# EasyEDA schematic pump system.json
TITLE: Sheet_1; REV: 1.0; Date: 2019-04-05; Sheet: 1/1; Drawn By: UserSupport; Company: Your Company
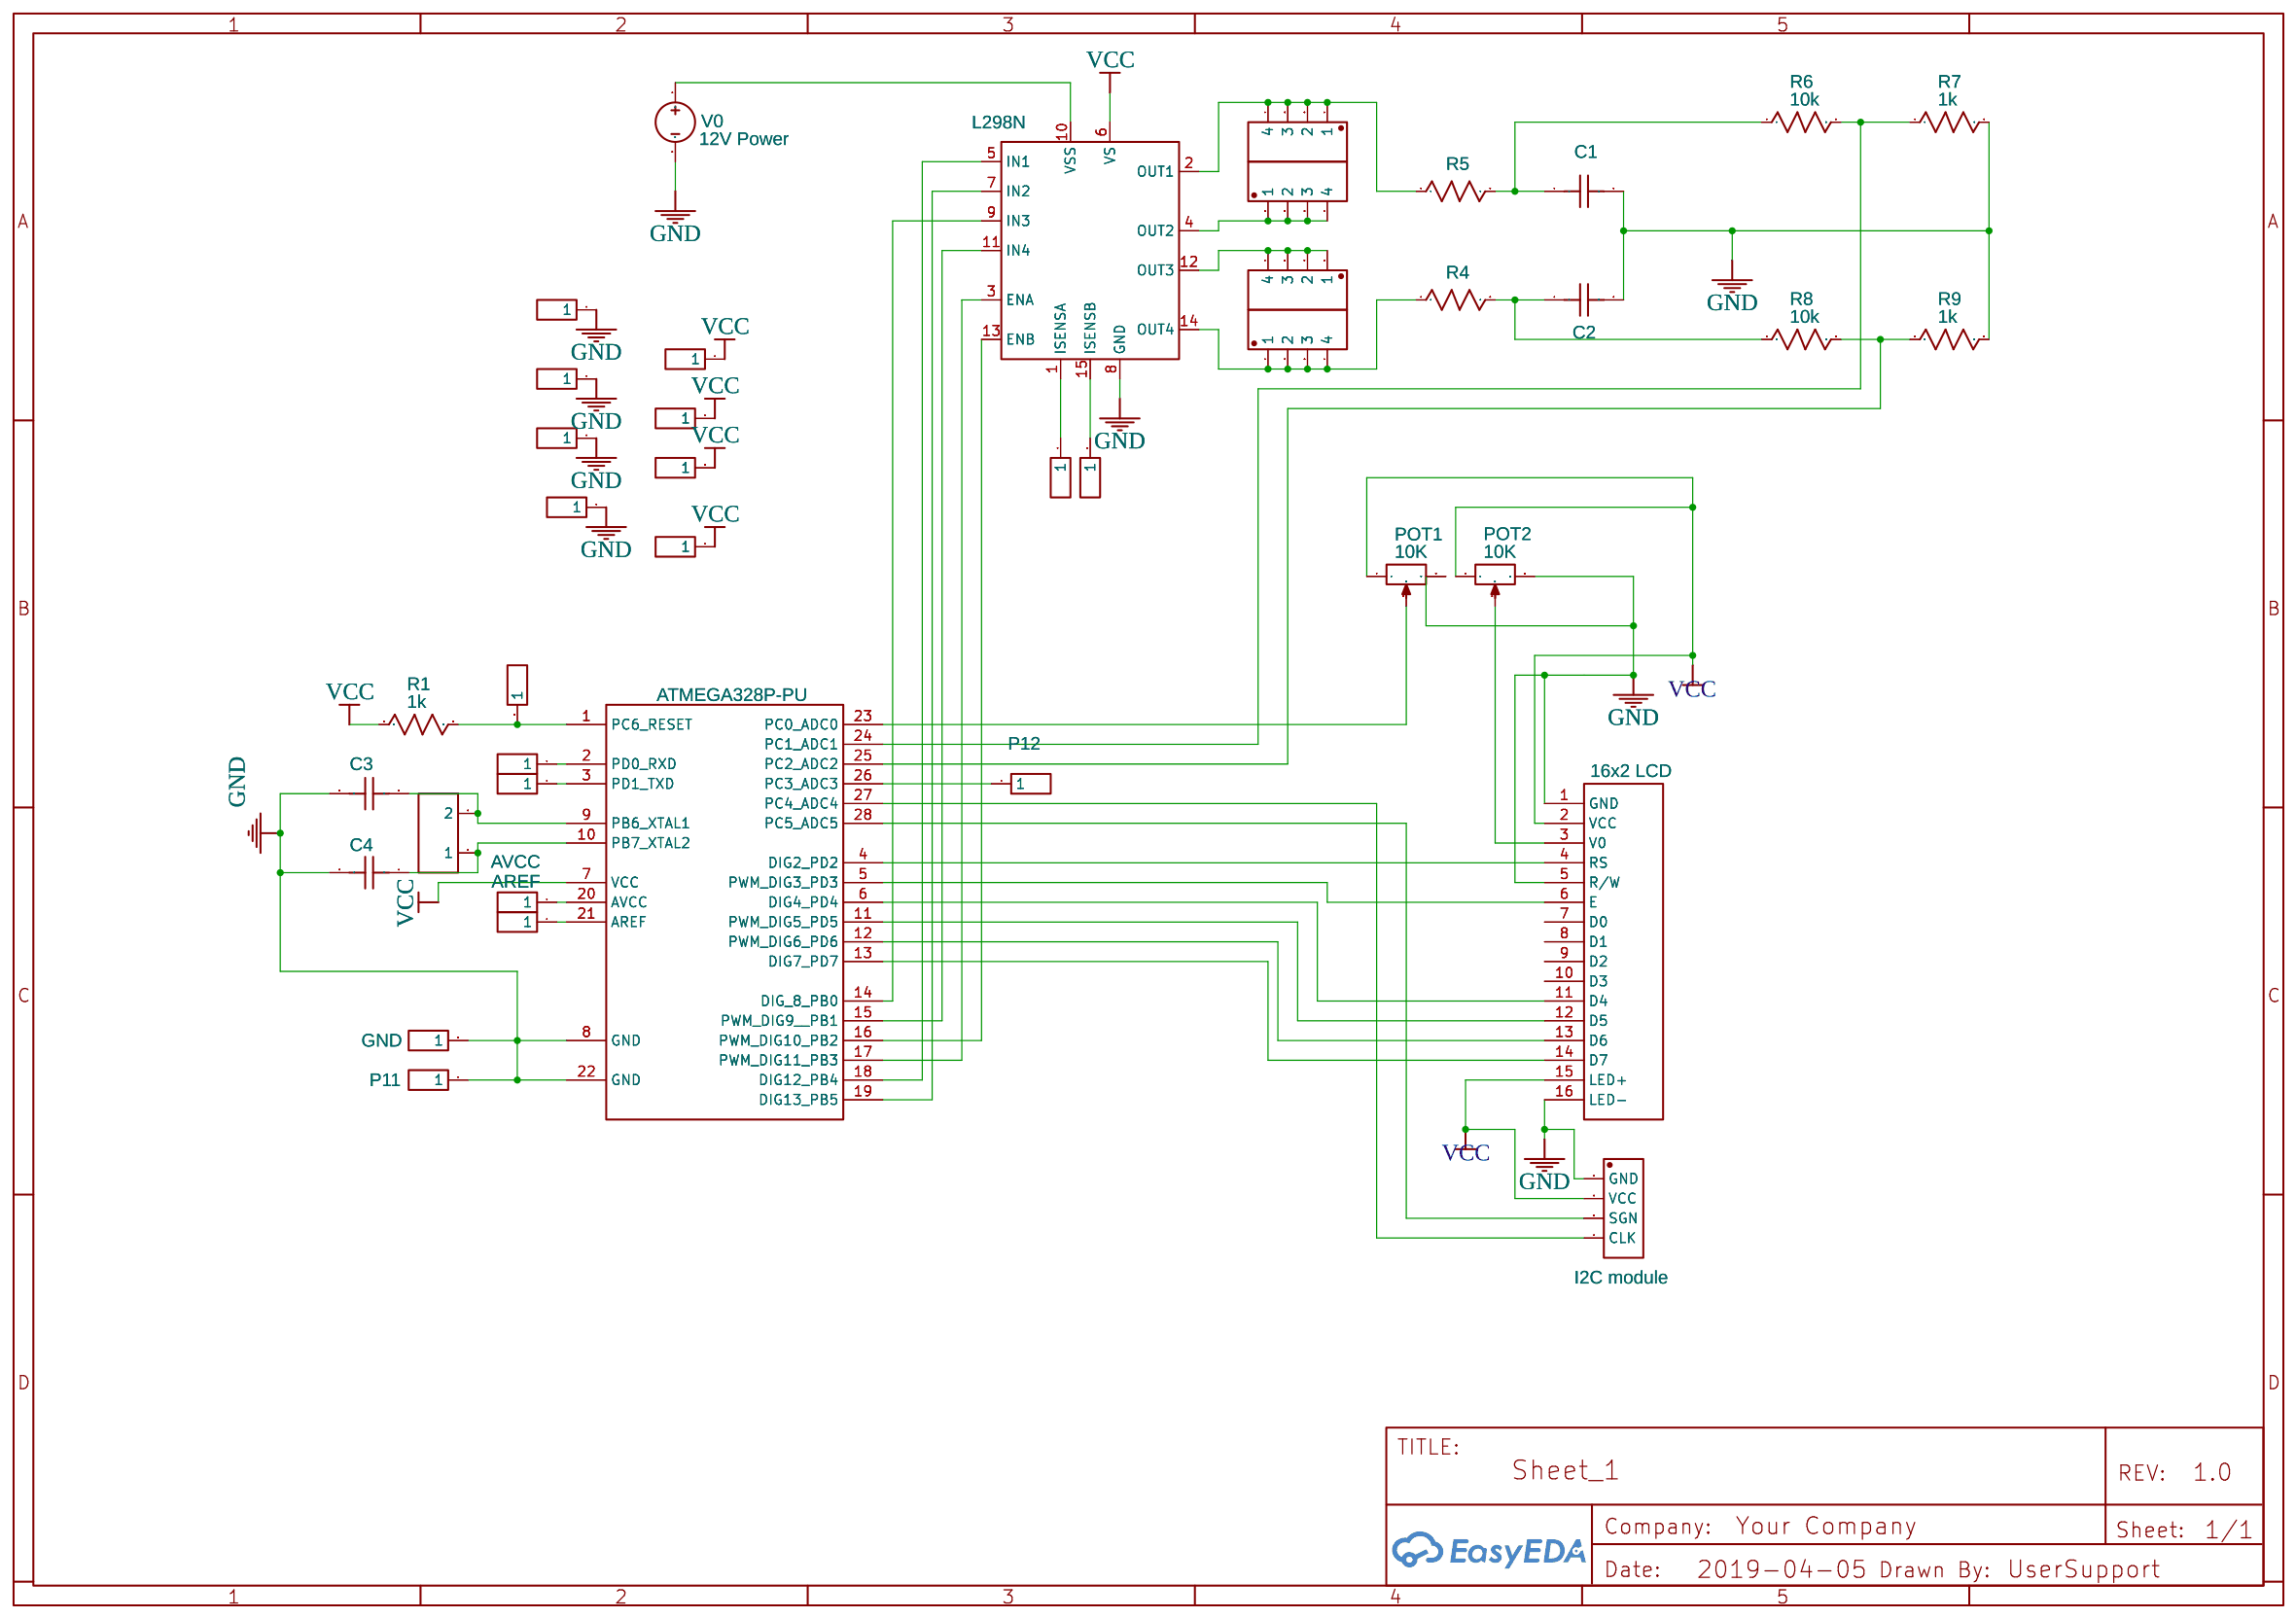
[diagram p0: schematic sheet]

## Parts
AREF  Header-Male-2.54_1x1  [HDR-1X1/2.54]
AVCC  Header-Male-2.54_1x1  [HDR-1X1/2.54]
C1  1u  [RAD-0.1]
C2  1u  [RAD-0.1]
C3  1u  [RAD-0.1]
C4  1u  [RAD-0.1]
GND  Header-Male-2.54_1x1  [HDR-1X1/2.54]
H1  I2C module  [DIP-1X4P-2.54MM-M]
H2  Header-Male-2.54_1x4  [DIP-1X4P-2.54MM-M]
H3  Header-Male-2.54_1x4  [DIP-1X4P-2.54MM-M]
H4  Header-Male-2.54_1x4  [DIP-1X4P-2.54MM-M]
H5  Header-Male-2.54_1x4  [DIP-1X4P-2.54MM-M]
H6  Header-Male-2.54_1x2  [HDR-2X1/2.54]
L298N  L298N Personal  [MULTIWATT15V PERSONAL]
P1  Header-Male-2.54_1x1  [HDR-1X1/2.54]
P2  Header-Male-2.54_1x1  [HDR-1X1/2.54]
P5  Header-Male-2.54_1x1  [HDR-1X1/2.54]
P7  Header-Male-2.54_1x1  [HDR-1X1/2.54]
P11  Header-Male-2.54_1x1  [HDR-1X1/2.54]
P12  Header-Male-2.54_1x1  [HDR-1X1/2.54]
P13  Header-Male-2.54_1x1  [HDR-1X1/2.54]
P14  Header-Male-2.54_1x1  [HDR-1X1/2.54]
P15  Header-Male-2.54_1x1  [HDR-1X1/2.54]
P16  Header-Male-2.54_1x1  [HDR-1X1/2.54]
P17  Header-Male-2.54_1x1  [HDR-1X1/2.54]
P18  Header-Male-2.54_1x1  [HDR-1X1/2.54]
POT1  10K  [RES-ADJ_3296W]
POT2  10K  [RES-ADJ_3296W]
R1  1k  [AXIAL-0.3]
R4  1k  [AXIAL-0.3]
R5  1k  [AXIAL-0.3]
R6  10k  [AXIAL-0.3]
R7  1k  [AXIAL-0.3]
R8  10k  [AXIAL-0.3]
R9  1k  [AXIAL-0.3]
RX  Header-Male-2.54_1x1  [HDR-1X1/2.54]
TX  Header-Male-2.54_1x1  [HDR-1X1/2.54]
U1  ATMEGA328P-PU  [DIP-28_300MIL]
U4  16x2 LCD  [HDR-16X1/2.54]
V0  12V Power  [HDR1X2]
VCC  PC6 RESET  [HDR-1X1/2.54]

## Library data of the parts
AREF AVCC GND P1 P2 P5 P7 P11-P18 RX TX = -: Supplier: LCSC; Manufacturer: ReliaPro; Supplier Part: C81276
C1-C4 = Cap_RAD-0.1_US: Manufacturer Part: ?
H1-H5 = -: Supplier: LCSC; Manufacturer: Ckmtw; Manufacturer Part: 210S-1*4P L=11.6MMGold-plated black; Contributor: LCSC; Supplier Part: C124378
H6 = -: Supplier: LCSC; Manufacturer: TE Connectivity; Manufacturer Part: 826629-2; image: //image.lceda.cn/szlcsc/C86471.jpg; Supplier Part: C86471
L298N = -: sourceId: HXUgCYWig; Supplier: LCSC; Manufacturer: STMicroelectronics; image: //image.lceda.cn/szlcsc/C19922.jpg; Supplier Part: C19922
POT1 POT2 = Precision potentiometer100Ω: Supplier: LCSC; Manufacturer: ReliaPro; Supplier Part: C13649
R1 R4-R9 = Res_AXIAL-0.3(1/8W)_US: Manufacturer Part: ?
U1 = -: sourceId: Oic6oiASL; Supplier: LCSC; Manufacturer: MICROCHIP; image: //image.lceda.cn/szlcsc/C33901.jpg; Contributor: LCSC; Supplier Part: C33901
U4 = -: Manufacturer Part: 16x2 LCD (HD44780); Contributor: Mjtt0514
V0 = Vsin: Manufacturer Part: ?
VCC = -: Supplier: LCSC; Manufacturer: ReliaPro; Manufacturer Part: Header-Male-2.54_1x1; Supplier Part: C81276

## Nets
GND: C1.2 C2.2 C3.2 C4.2 GND.1 H1.1(GND) L298N.8(GND) P1.1 P2.1 P5.1 P7.1 P11.1 POT1.3 POT2.3 R7.2 R9.2 U1.8(GND) U1.22(GND) U4.1(GND) U4.5(R/W) U4.16(LED-) V0.2
VCC: H1.2(VCC) L298N.6(VS) P15.1 P16.1 P17.1 P18.1 POT1.1 POT2.1 R1.1 U1.7(VCC) U4.2(VCC) U4.15(LED+)
Net-(AREF-1): AREF.1 U1.21(AREF)
Net-(AVCC-1): AVCC.1 U1.20(AVCC)
Net-(C1-1): C1.1 R5.2 R6.1
Net-(C2-1): C2.1 R4.2 R8.1
Net-(C3-1): C3.1 H6.2 U1.9(PB6 XTAL1)
Net-(C4-1): C4.1 H6.1 U1.10(PB7 XTAL2)
Net-(H1-3): H1.3(SGN) U1.28(PC5 ADC5)
Net-(H1-4): H1.4(CLK) U1.27(PC4 ADC4)
Net-(H2-1): H2.1 H2.2 H2.3 H2.4 L298N.4(OUT2)
Net-(H3-1): H3.1 H3.2 H3.3 H3.4 L298N.2(OUT1) R5.1
Net-(H4-1): H4.1 H4.2 H4.3 H4.4 L298N.14(OUT4) R4.1
Net-(H5-1): H5.1 H5.2 H5.3 H5.4 L298N.12(OUT3)
Net-(L298N-1): L298N.1(ISENSA) P14.1
Net-(L298N-3): L298N.3(ENA) U1.17(PWM DIG11 PB3)
Net-(L298N-5): L298N.5(IN1) U1.18(DIG12 PB4)
Net-(L298N-7): L298N.7(IN2) U1.19(DIG13 PB5)
Net-(L298N-9): L298N.9(IN3) U1.14(DIG 8 PB0)
Net-(L298N-10): L298N.10(VSS) V0.1
Net-(L298N-11): L298N.11(IN4) U1.15(PWM DIG9  PB1)
Net-(L298N-13): L298N.13(ENB) U1.16(PWM DIG10 PB2)
Net-(L298N-15): L298N.15(ISENSB) P13.1
Net-(P12-1): P12.1 U1.26(PC3 ADC3)
Net-(POT1-2): POT1.2 U1.23(PC0 ADC0)
Net-(POT2-2): POT2.2 U4.3(V0)
Net-(R1-2): R1.2 U1.1(PC6 RESET) VCC.1
Net-(R6-2): R6.2 R7.1 U1.24(PC1 ADC1)
Net-(R8-2): R8.2 R9.1 U1.25(PC2 ADC2)
Net-(RX-1): RX.1 U1.2(PD0 RXD)
Net-(TX-1): TX.1 U1.3(PD1 TXD)
Net-(U1-4): U1.4(DIG2 PD2) U4.4(RS)
Net-(U1-5): U1.5(PWM DIG3 PD3) U4.6(E)
Net-(U1-6): U1.6(DIG4 PD4) U4.11(D4)
Net-(U1-11): U1.11(PWM DIG5 PD5) U4.12(D5)
Net-(U1-12): U1.12(PWM DIG6 PD6) U4.13(D6)
Net-(U1-13): U1.13(DIG7 PD7) U4.14(D7)

Not connected (* = marked no-connect by the designer): U4 7(D0) 8(D1) 9(D2) 10(D3)
